# Altium project 3EWL1-200001.PrjPcb
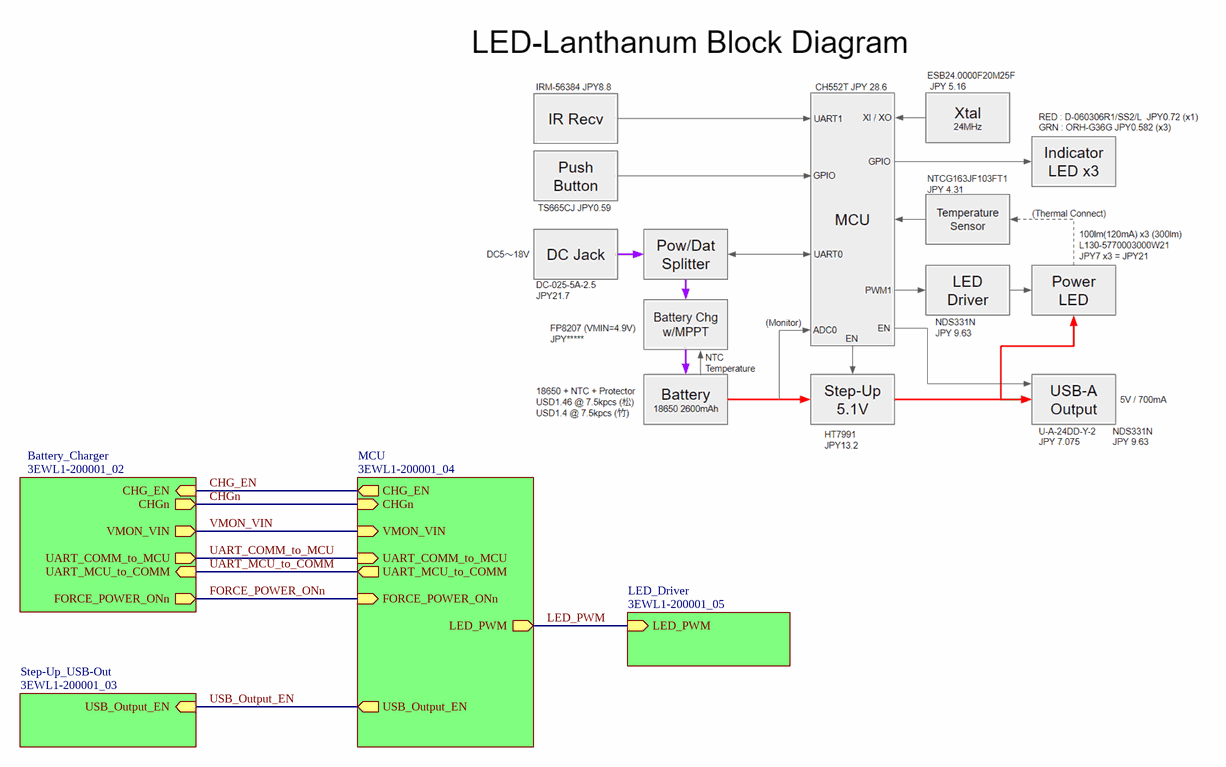
[diagram p0: 3EWL1-200001_01.SchDoc]
5 sheets, 155 parts. Net scope: hierarchical (ports join the sheet entries above them; power ports are global).
Board files: 3EWL1-200001.PcbDoc, 3EWL1-200001_panelize.PcbDoc
Sheets:
  3EWL1-200001_01.SchDoc
    Battery_Charger = 3EWL1-200001_02.SchDoc
    Step-Up_USB-Out = 3EWL1-200001_03.SchDoc
    MCU = 3EWL1-200001_04.SchDoc
    LED_Driver = 3EWL1-200001_05.SchDoc

## Sheet 3EWL1-200001_01.SchDoc: WASSA_Lantern
size A4; Engineer: cronos; Revision: 6A1.0; SheetNumber: 1; SheetTotal: 5

### Sub-sheets
Battery_Charger = 3EWL1-200001_02: CHG_EN (in), VMON_VIN (out), CHGn (out), UART_COMM_to_MCU (out), UART_MCU_to_COMM (in), FORCE_POWER_ONn (out)
LED_Driver = 3EWL1-200001_05: LED_PWM (in)
MCU = 3EWL1-200001_04: USB_Output_EN (out), FORCE_POWER_ONn (in), UART_MCU_to_COMM (out), VMON_VIN (in), CHGn (in), CHG_EN (out), LED_PWM (out), UART_COMM_to_MCU (in)
Step-Up_USB-Out = 3EWL1-200001_03: USB_Output_EN (in)

### Nets
CHG_EN: sheet Battery_Charger/CHG_EN, sheet MCU/CHG_EN
CHGn: sheet Battery_Charger/CHGn, sheet MCU/CHGn
FORCE_POWER_ONn: sheet Battery_Charger/FORCE_POWER_ONn, sheet MCU/FORCE_POWER_ONn
LED_PWM: sheet MCU/LED_PWM, sheet LED_Driver/LED_PWM
UART_COMM_to_MCU: sheet Battery_Charger/UART_COMM_to_MCU, sheet MCU/UART_COMM_to_MCU
UART_MCU_to_COMM: sheet Battery_Charger/UART_MCU_to_COMM, sheet MCU/UART_MCU_to_COMM
USB_Output_EN: sheet Step-Up_USB-Out/USB_Output_EN, sheet MCU/USB_Output_EN
VMON_VIN: sheet Battery_Charger/VMON_VIN, sheet MCU/VMON_VIN

### Notes on the sheet
- Model
- Title
- Rev.
- Size
- Filename
- Comment
- Date
- Design
- A4
- Sheet          of

## Sheet 3EWL1-200001_02.SchDoc: Lantern PowerStage
size A4; Engineer: cronos; Revision: 6A1.0; SheetNumber: 2; SheetTotal: 5
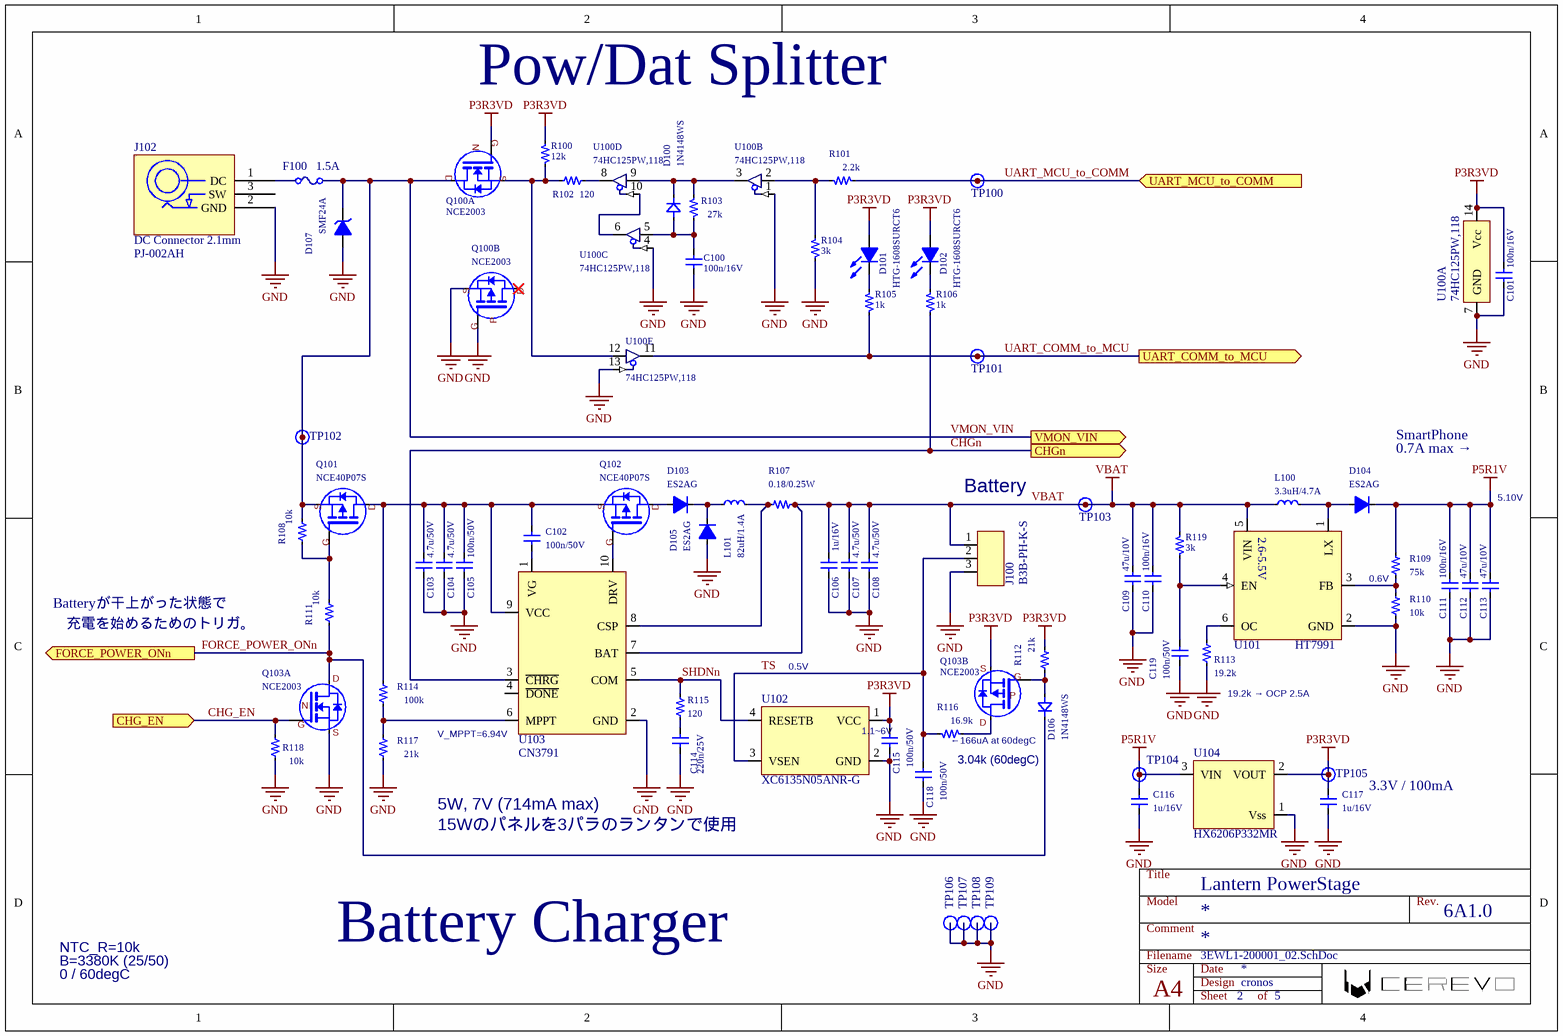
[diagram p1: 3EWL1-200001_02.SchDoc]

### Parts
C100  100n/16V  [SC2-1.00X0.50A]
C101  100n/16V  [SC2-1.00X0.50A]
C102  100n/50V  [SC2-1.00X0.50A]
C103  4.7u/50V  [SC2-3.20X1.60A]
C104  4.7u/50V  [SC2-3.20X1.60A]
C105  100n/50V  [SC2-1.00X0.50A]
C106  1u/16V  [SC2-1.00X0.50A]
C107  4.7u/50V  [SC2-3.20X1.60A]
C108  4.7u/50V  [SC2-3.20X1.60A]
C109  47u/10V  [SC2-3.20X2.50A]
C110  100n/16V  [SC2-1.00X0.50A]
C111  100n/16V  [SC2-1.00X0.50A]
C112  47u/10V  [SC2-3.20X2.50A]
C113  47u/10V  [SC2-3.20X2.50A]
C114  220n/25V  [SC2-1.00X0.50A]
C115  100n/50V  [SC2-1.00X0.50A]
C116  1u/16V  [SC2-1.00X0.50A]
C117  1u/16V  [SC2-1.00X0.50A]
C118  100n/50V  [SC2-1.00X0.50A]
C119  100n/50V  [SC2-1.00X0.50A]
D100  1N4148WS  [SD2-1.7X1.25A]
D101  HTG-1608SURCT6  [SOD-523F_CAPM3216X18N]
D102  HTG-1608SURCT6  [SOD-523F_CAPM3216X18N]
D103  ES2AG  [diodes_SMA]
D104  ES2AG  [diodes_SMA]
D105  ES2AG  [diodes_SMA]
D106  1N4148WS  [SD2-1.7X1.25A]
D107  SMF24A  [SOD-123]
F100  1.5A  [SR2-1.60X0.80A]
J100  B3B-PH-K-S  [B3B-PH-K-S]
J102  DC Connector 2.1mm  Manufacturer Part Number: PJ-002AH  [Connector_PJ-002AH]
L100  3.3uH/4.7A  [VLC6045]
L101  82uH/1.4A  [SCDS125T-820M-N]
Q100  NCE2003  [SOT23-6]  (parts A,B of 2)
Q101  NCE40P07S  [SOIC127P610X104_HS-9M]
Q102  NCE40P07S  [SOIC127P610X104_HS-9M]
Q103  NCE2003  [SOT23-6]  (parts A,B of 2)
R100  12k  [SR2-1.00X0.50A]
R101  2.2k  [SR2-1.00X0.50A]
R102  120  [SR2-1.00X0.50A]
R103  27k  [SR2-1.00X0.50A]
R104  3k  [SR2-1.00X0.50A]
R105  1k  [SR2-1.00X0.50A]
R106  1k  [SR2-1.00X0.50A]
R107  0.18/0.25W  [SR2-3.20X1.60A]
R108  10k  [SR2-1.00X0.50A]
R109  75k  [SR2-1.00X0.50A]
R110  10k  [SR2-1.00X0.50A]
R111  10k  [SR2-1.00X0.50A]
R112  21k  [SR2-1.00X0.50A]
R113  19.2k  [SR2-1.00X0.50A]
R114  100k  [SR2-1.00X0.50A]
R115  120  [SR2-1.00X0.50A]
R116  16.9k  [SR2-1.00X0.50A]
R117  21k  [SR2-1.00X0.50A]
R118  10k  [SR2-1.00X0.50A]
R119  3k  [SR2-1.00X0.50A]
TP100  TP  [1.0mmTH]  (value not drawn)
TP101  TP  [1.0mmTH]  (value not drawn)
TP102  TP  [1.0mmTH]  (value not drawn)
TP103  TP  [1.0mmTH]  (value not drawn)
TP104  TP  [1.0mmTH]  (value not drawn)
TP105  TP  [1.0mmTH]  (value not drawn)
TP106  TP  [1.0mmTH]  (value not drawn)
TP107  TP  [1.0mmTH]  (value not drawn)
TP108  TP  [1.0mmTH]  (value not drawn)
TP109  TP  [1.0mmTH]  (value not drawn)
U100  74HC125PW,118  [TSSOP14_e=0.65]  (parts A,B,C,D,E of 5)
U101  HT7991  [SOT23-6]
U102  XC6135N05ANR-G  [XC6135N05ANR-G]
U103  CN3791  [CN3791]
U104  HX6206P332MR  [SOT23-3]

### Ports
CHG_EN (in), CHGn (out), FORCE_POWER_ONn (out), UART_COMM_to_MCU (out), UART_MCU_to_COMM (in), VMON_VIN (out)

### Nets
GND: C100.2 C101.2 C103.1 C104.1 C105.2 C106.2 C107.1 C108.1 C109.1 C110.2 C111.2 C112.1 C113.1 C114.1 C115.2 C116.2 C117.2 C118.2 C119.2 D105.A D107.A J100.3 J102.2(GND) Q100.2(P_S) Q100.3(P_G) Q103.5(N_S) R104.2 R110.2 R113.2 R117.2 R118.2 TP106.1(TP1) TP107.1(TP1) TP108.1(TP1) TP109.1(TP1) U100.1(1OE) U100.4(2OE) U100.7(GND) U100.13(4OE) U101.2(GND) U102.2(GND) U103.2(GND) U104.1(Vss)
P3R3VD: C101.1 C115.1 C117.1 D101.A D102.A Q100.1(N_G) Q103.2(P_S) R100.1 R112.1 TP105.1(TP1) U100.14(Vcc) U102.1(VCC) U104.2(VOUT)
P5R1V: C111.1 C112.2 C113.2 C116.1 D104.C R109.1 TP104.1(TP1) U104.3(VIN)
VBAT: C106.1 C107.2 C108.2 C109.2 C110.1 J100.1 L100.1 R107.2 R119.1 TP103.1(TP1) U101.5(VIN) U103.7(BAT)
CHG_EN: Q103.1(N_G) R118.1 ; port CHG_EN
CHGn: R106.1 U103.3(~{CHRG}) ; port CHGn
FORCE_POWER_ONn: D106.K Q103.6(N_D) R111.2 ; port FORCE_POWER_ONn
SHDNn: R115.2 U102.4(RESETB) U103.5(COM)
TS: C118.1 J100.2 R116.2 U102.3(VSEN)
UART_COMM_to_MCU: R105.1 TP101.1(TP1) U100.11(4Y) ; port UART_COMM_to_MCU
UART_MCU_to_COMM: R101.1 TP100.1(TP1) ; port UART_MCU_to_COMM
VMON_VIN: D107.C F100.2 Q100.6(N_D) Q101.2(S) R108.1 TP102.1(TP1) ; port VMON_VIN
NetC100_1: C100.1 D100.A R103.2 U100.5(2A)
NetC102_1: C102.1 C103.2 C104.2 C105.1 Q101.3(D) Q102.2(S) R114.1 U103.9(VCC)
NetC102_2: C102.2 U103.1(VG)
NetC114_2: C114.2 R115.1
NetC119_1: C119.1 R119.2 U101.4(EN)
NetD100_K: D100.K R103.1 U100.3(1Y) U100.9(3A)
NetD101_C: D101.C R105.2
NetD102_C: D102.C R106.2
NetD103_A: D103.A Q102.3(D)
NetD103_C: D103.C D105.C L101.1
NetD104_A: D104.A L100.2 U101.1(LX)
NetD106_A: D106.A Q103.3(P_G) R112.2
NetF100_1: F100.1 J102.1(DC)
NetL101_2: L101.2 R107.1 U103.8(CSP)
NetQ100_5: Q100.5(N_S) R100.2 R102.2 U100.12(4A)
NetQ101_1: Q101.1(G) R108.2 R111.1
NetQ102_1: Q102.1(G) U103.10(DRV)
NetQ103_4: Q103.4(P_D) R116.1
NetR101_2: R101.2 R104.1 U100.2(1A)
NetR102_1: R102.1 U100.8(3Y)
NetR109_2: R109.2 R110.1 U101.3(FB)
NetR113_1: R113.1 U101.6(OC)
NetR114_2: R114.2 R117.1 U103.6(MPPT)
NetU100_6: U100.6(2Y) U100.10(3OE)

Not connected (* = marked no-connect by the designer): J102 3(SW); Q100 4(P_D)*; U103 4(~{DONE})

### Notes on the sheet
- Pow/Dat Splitter
- SmartPhone
- Battery
- 0.7A max →
- 5.10V
- 0.6V
- Batteryが干上がった状態で
- 充電を始めるためのトリガ。
- (near U102) 0.5V
- (near R113) 19.2k → OCP 2.5A
- (near U103) V_MPPT=6.94V
- (near R116) ←166uA at 60degC
- 3.04k (60degC)
- 3.3V / 100mA
- 5W, 7V (714mA max)
- 15Wのパネルを3パラのランタンで使用
- 0 / 60degC
- B=3380K (25/50)
- NTC_R=10k
- Battery Charger
- Model
- Title
- Rev.
- Size
- Filename
- Comment
- Date
- Design
- A4
- Sheet          of
- (in symbol HT7991) 2.6-5.5V
- (in symbol NCE2003, part A) D; N; G; S
- (in symbol NCE2003, part B) S; G; P; D
- (in symbol XC6135N05ANR-G) 1.1~6V

### Library data of the parts
C100 C101 C110 C111 = C: 100n, 16V, X7R, 1005Size; Manufacturer: TDK; Manufacturer Part Number: C1005X5R1C104KT000N; Description 1: Capacitor (non-polar); Commodity: MLCC; Replace: OK; FirstPublished: 2012/10/14; LatestRevisionDate: *; LatestRevisionNote: *; Mounting: *; Description 2: *; Footprint(imperial): 0402; Footprint(metric): 1005; Value: 100n/16V
C102 C105 C115 C118 C119 = C: 100n, 50V, X7R, 1005Size; Manufacturer: Walsin; Manufacturer Part Number: 0402B104K500CT; Description 1: Capacitor (non-polar); Commodity: MLCC; Replace: OK; FirstPublished: 2012/10/14; LatestRevisionDate: *; LatestRevisionNote: *; Mounting: *; Description 2: *; Footprint(imperial): 0402; Footprint(metric): 1005; Value: 100n/50V
C103 C104 C107 C108 = C: 4.7u/50V, X7R, 3216Size; Manufacturer: Murata; Manufacturer Part Number: GRM31CR71H475KA12L; Commodity: MLCC; Replace: OK; Mounting: *; Footprint(imperial): 1206; Footprint(metric): 3216; Value: 4.7u/50V
C106 C116 C117 = C: 1u, 16V, X7R, 1005Size; Manufacturer: Yageo; Manufacturer Part Number: CC0805KKX7R7BB105; Description 1: Capacitor (non-polar); Commodity: MLCC; Replace: OK; FirstPublished: 2012/10/14; LatestRevisionDate: *; LatestRevisionNote: *; Mounting: *; Description 2: *; Footprint(imperial): 0402; Footprint(metric): 1005; Value: 1u/16V
C109 C112 C113 = C: 47u/10V, X7R, 3225Size; Manufacturer: Murata; Manufacturer Part Number: GRM32ER71A476KE15L; Commodity: MLCC; Replace: OK; Mounting: *; Footprint(imperial): 1210; Footprint(metric): 3225; Value: 47u/10V
C114 = C: 220n, 25V, X7R, 1005Size; Manufacturer: Walsin; Manufacturer Part Number: 0402B224K250CT; Description 1: Capacitor (non-polar); Commodity: MLCC; Replace: OK; FirstPublished: 2012/10/14; LatestRevisionDate: *; LatestRevisionNote: *; Mounting: *; Description 2: *; Footprint(imperial): 0402; Footprint(metric): 1005; Value: 220n/25V
D100 D106 = 1N4148WS: Diode Signal 75V 150mA 1712; Manufacturer: Fairchild Semiconductor; Description 2: 75V 150MA SOD323F; Commodity: Diode Small Dignal; Replace: OK; Manufacturer Part Number: 1N4148WS; Mounting: *; Value: 1N4148WS
D101 D102 = Diode_LED: Manufacturer: HTGLight; Commodity: LED; Replace: OK; Value: HTG-1608SURCT6; Manufacturer Part Number: HTG-1608SURCT6; Footprint(imperial): 0603; Footprint(metric): 1608
D103-D105 = Diode_switching: 50V, 2A, Vf_2A=1V, 35nSec, SMA; Manufacturer: Shikues; Commodity: Diode; Replace: OK; Manufacturer Part Number: ES2AG; Mounting: *; Value: ES2AG
D107 = Diode_Zenner: Manufacturer: DOWO; Commodity: TVS; Replace: OK; Manufacturer Part Number: SMF24A; Mounting: *; Value: SMF24A
F100 = Fuse: 1.5A, 32V, 1608Size; Manufacturer: Shenzhen lanson Elec; Manufacturer Part Number: 06H1150D; Replace: NG; Commodity: Fuse; Value: 1.5A; Footprint(imperial): 0603; Footprint(metric): 1608
J100 = Con3: PH 3pin 2mm pitch; Manufacturer: JST; Replace: NG; Commodity: Connector; Manufacturer Part Number: B3B-PH-K-S; Mounting: *; Value: B3B-PH-K-S
J102 = Connector - DC_PJ-002AH: Connector - DC 12V; Manufacturer: CUI Inc.; Replace: NG; Mounting: *; Commodity: Connector; Value: PJ-002AH
L100 = L: 3.3uH, 4.7A, 6x6x4.5mm; Manufacturer: TDK; Manufacturer Part Number: VLC6045T-3R3N; Commodity: Inductor; Replace: OK; PackageReference: *; Mounting: *; Footprint (imperial): 6 x 6 x 4.5mm; Value: 3.3uH/4.7A
L101 = L: 82uH, 1.4A, 12.5x12.5x6mm; Manufacturer: Chilisin Elec; Commodity: Inductor; Replace: OK; PackageReference: *; Manufacturer Part Number: SCDS125T-820M-N; Mounting: *; Footprint (imperial): 12.5 x 12.5 x 6.0mm; Value: 82uH/1.4A
Q100 Q103 = NCE2003: N(20V, 55mohm, Vgs(th)=1.2V ), P(-20V, 100mohm, Vgs(th)=-1V), SOT23-6; Manufacturer: ncepower; Commodity: MOSFET; Replace: OK; Mounting: *; Manufacturer Part Number: NCE2003; Value: NCE2003
Q101 Q102 = Pch_MOSFET: -40V, -6.2A, 30mohm; pin to pad: 1>2 2>1; Manufacturer: Wuxi NCE Power Semiconductor; Commodity: MOSFET; Replace: OK; Manufacturer Part Number: NCE40P07S; Mounting: *; Value: NCE40P07S
R100 = R: 12k, 1%, 1005Size; Manufacturer: YAGEO; Manufacturer Part Number: RC0402FR-0712KL; Description 1: Resistor; Replace: OK; FirstPublished: 2012/10/14; LatestRevisionDate: *; LatestRevisionNote: *; PackageReference: *; Mounting: *; Description 2: *; Value: 12k; Commodity: Resistor; Footprint(imperial): 0402; Footprint(metric): 1005
R101 = R: 2.2k, 1%, 1005Size; Manufacturer: YAGEO; Manufacturer Part Number: RC0402FR-072K2RL; Description 1: Resistor; Replace: OK; FirstPublished: 2012/10/14; LatestRevisionDate: *; LatestRevisionNote: *; PackageReference: *; Mounting: *; Description 2: *; Value: 2.2k; Commodity: Resistor; Footprint(imperial): 0402; Footprint(metric): 1005
R102 R115 = R: 120, 1%, 1005Size; Manufacturer: YAGEO; Manufacturer Part Number: RC0402FR-07120RL; Description 1: Resistor; Replace: OK; FirstPublished: 2012/10/14; LatestRevisionDate: *; LatestRevisionNote: *; PackageReference: *; Mounting: *; Description 2: *; Value: 120; Commodity: Resistor; Footprint(imperial): 0402; Footprint(metric): 1005
R103 = R: 27k, 1%, 1005Size; Manufacturer: YAGEO; Manufacturer Part Number: RC0402FR-0727KL; Description 1: Resistor; Replace: OK; FirstPublished: 2012/10/14; LatestRevisionDate: *; LatestRevisionNote: *; PackageReference: *; Mounting: *; Description 2: *; Value: 27k; Commodity: Resistor; Footprint(imperial): 0402; Footprint(metric): 1005
R104 R119 = R: 3k, 1%, 1005Size; Manufacturer: YAGEO; Manufacturer Part Number: RC0402FR-073KL; Description 1: Resistor; Replace: OK; FirstPublished: 2012/10/14; LatestRevisionDate: *; LatestRevisionNote: *; PackageReference: *; Mounting: *; Description 2: *; Value: 3k; Commodity: Resistor; Footprint(imperial): 0402; Footprint(metric): 1005
R105 R106 = R: Rsisiter 2pin; Manufacturer: Yageo; Manufacturer Part Number: RC0402FR-071KL; Description 1: Resistor; Replace: OK; FirstPublished: 2012/10/14; LatestRevisionDate: *; LatestRevisionNote: *; Mounting: *; Description 2: *; Commodity: Resistor; Footprint(imperial): 0402; Footprint(metric): 1005; Value: 1k
R107 = R: 0.18, 0.25W, 1%, 800ppm; Manufacturer: UNI-ROYAL; Manufacturer Part Number: 1206W4F180LT5E; Commodity: Resistor; Replace: OK; Mounting: *; Footprint(imperial): 1206; Footprint(metric): 3216; Value: 0.18/0.25W
R108 R110 R111 R118 = R: Manufacturer: YAGEO; Manufacturer Part Number: RC0402FR-0710KL; Description 1: Resistor; Replace: OK; FirstPublished: 2012/10/14; LatestRevisionDate: *; LatestRevisionNote: *; PackageReference: *; Mounting: *; Description 2: *; Value: 10k; Commodity: Resistor; Footprint(imperial): 0402; Footprint(metric): 1005
R109 = R: Manufacturer: YAGEO; Manufacturer Part Number: RC0402FR-0775KL; Description 1: Resistor; Replace: OK; FirstPublished: 2012/10/14; LatestRevisionDate: *; LatestRevisionNote: *; PackageReference: *; Mounting: *; Description 2: *; Value: 75k; Commodity: Resistor; Footprint(imperial): 0402; Footprint(metric): 1005
R112 R117 = R: 21k, 1%, 1005Size; Manufacturer: YAGEO; Manufacturer Part Number: RC0402FR-0721KL; Description 1: Resistor; Replace: OK; FirstPublished: 2012/10/14; LatestRevisionDate: *; LatestRevisionNote: *; PackageReference: *; Mounting: *; Description 2: *; Value: 21k; Commodity: Resistor; Footprint(imperial): 0402; Footprint(metric): 1005
R113 = R: Manufacturer: YAGEO; Manufacturer Part Number: RC0402FR-0719K2L; Description 1: Resistor; Replace: OK; FirstPublished: 2012/10/14; LatestRevisionDate: *; LatestRevisionNote: *; PackageReference: *; Mounting: *; Description 2: *; Value: 19.2k; Commodity: Resistor; Footprint(imperial): 0402; Footprint(metric): 1005
R114 = R: 100k, 1%, 1005Size; Manufacturer: YAGEO; Manufacturer Part Number: RC0402FR-07100KL; Description 1: Resistor; Replace: OK; FirstPublished: 2012/10/14; LatestRevisionDate: *; LatestRevisionNote: *; PackageReference: *; Mounting: *; Description 2: *; Value: 100k; Commodity: Resistor; Footprint(imperial): 0402; Footprint(metric): 1005
R116 = R: 16.9k, 1%, 1005Size; Manufacturer: YAGEO; Manufacturer Part Number: RC0402FR-0716K9L; Description 1: Resistor; Replace: OK; FirstPublished: 2012/10/14; LatestRevisionDate: *; LatestRevisionNote: *; PackageReference: *; Mounting: *; Description 2: *; Value: 16.9k; Commodity: Resistor; Footprint(imperial): 0402; Footprint(metric): 1005
TP100-TP109 = TP: Mounting: NM
U100 = 74HC125: 3-State Quad Buffer; Manufacturer: NXP; Commodity: Logic; Replace: OK; Manufacturer Part Number: 74HC125PW,118; Mounting: *; Value: 74HC125PW,118
U101 = HT7991: boost, 2.6-5.5V, 2.5A, 1MHz; Manufacturer: Holtek; Commodity: SMPS; Replace: OK; Manufacturer Part Number: HT7991; Mounting: *; Value: HT7991
U102 = XC6135N05ANR-G: Voltage Detector Vth=0.5V; Manufacturer: TOREX; Replace: OK; Commodity: Voltage Detector; Manufacturer Part Number: XC6135N05ANR-G; Mounting: *; Value: XC6135N05ANR-G
U103 = CN3791: 8:1 Multiplexer; Manufacturer: CONSONANCE; Commodity: Li Charger; Replace: OK; Manufacturer Part Number: CN3791; Mounting: *; Value: CN3791
U104 = HX6206P332MR: 3.3V 100mA SOT-23; Manufacturer: hengjiaxing; Commodity: Linear Voltage Reg; Replace: NG; Manufacturer Part Number: HX6206P332MR; Value: HX6206P332MR

## Sheet 3EWL1-200001_03.SchDoc: Lantern USB-PowerPort
size A4; Engineer: cronos; Revision: 6A1.0; SheetNumber: 3; SheetTotal: 5
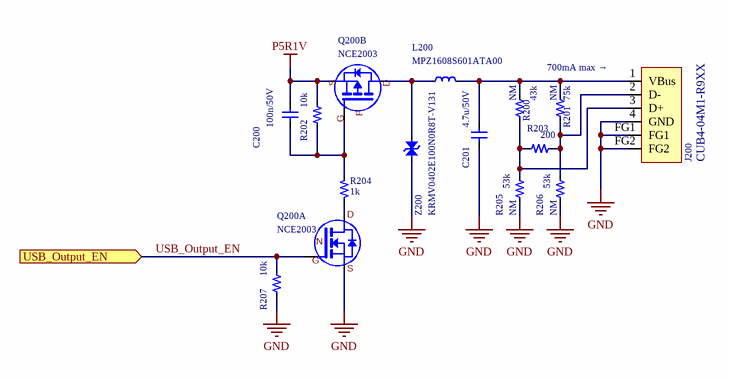
[diagram p2: 3EWL1-200001_03.SchDoc]

### Parts
C200  100n/50V  [SC2-1.00X0.50A]
C201  4.7u/50V  [SC2-3.20X1.60A]
J200  CUB4-04M1-R9XX  [CUB4-04M1-R9XX]
L200  MPZ1608S601ATA00  [SL2-1.60X0.80A]
Q200  NCE2003  [SOT23-6]  (parts A,B of 2)
R200  Mounting: NM  [SR2-1.00X0.50A]  (hidden comment: 43k)
R201  Mounting: NM  [SR2-1.00X0.50A]  (hidden comment: 75k)
R202  10k  [SR2-1.00X0.50A]
R203  200  [SR2-1.00X0.50A]
R204  1k  [SR2-1.00X0.50A]
R205  Mounting: NM  [SR2-1.00X0.50A]  (hidden comment: 53k)
R206  Mounting: NM  [SR2-1.00X0.50A]  (hidden comment: 53k)
R207  10k  [SR2-1.00X0.50A]
Z200  KRMV0402E100N0R8T-V131  [SR2-1.00X0.50A]

### Ports
USB_Output_EN (in)

### Nets
GND: C201.1 J200.4(GND) J200.FG1 J200.FG2 Q200.5(N_S) R205.2 R206.2 R207.2 Z200.1
P5R1V: C200.1 Q200.2(P_S) R202.1
USB_Output_EN: Q200.1(N_G) R207.1 ; port USB_Output_EN
NetC200_2: C200.2 Q200.3(P_G) R202.2 R204.2
NetC201_2: C201.2 J200.1(VBus) L200.2 R200.1 R201.1
NetJ200_2: J200.2(D-) R201.2 R203.2 R206.1
NetJ200_3: J200.3(D+) R200.2 R203.1 R205.1
NetL200_1: L200.1 Q200.4(P_D) Z200.2
NetQ200_6: Q200.6(N_D) R204.1

### Notes on the sheet
- 700mA max →
- Model
- Title
- Rev.
- Size
- Filename
- Comment
- Date
- Design
- A4
- Sheet          of
- (in symbol NCE2003, part A) D; N; G; S
- (in symbol NCE2003, part B) S; D; P; G

### Library data of the parts
C200 = C: as C102 on sheet 3EWL1-200001_02; FirstPublished: 2012/10/14; LatestRevisionDate: *; LatestRevisionNote: *; Mounting: *; Description 2: *; Footprint(imperial): 0402; Footprint(metric): 1005; Value: 100n/50V
C201 = C: as C103 on sheet 3EWL1-200001_02; Mounting: *; Footprint(imperial): 1206; Footprint(metric): 3216; Value: 4.7u/50V
J200 = CUB4-04M1-R9XX: USB-A; Manufacturer: Youte Electronic; Replace: OK; Value: CUB4-04M1-R9XX; Mounting: *; Manufacturer Part Number: CUB4-04M1-R9XX
L200 = L: 600ohm/1.0A/150mohm; Manufacturer: TDK; Commodity: RFC; Replace: OK; FirstPublished: 2012/10/14; LatestRevisionDate: *; LatestRevisionNote: *; PackageReference: *; Manufacturer Part Number: MPZ1608S601ATA00; Mounting: *; Footprint(imperial): '0603; Footprint(metric): 1608; Value: 600ohm/1.0A/150mohm
Q200 = NCE2003: as Q100 on sheet 3EWL1-200001_02; Mounting: *; Manufacturer Part Number: NCE2003; Value: NCE2003
R200 = R: Manufacturer: YAGEO; Manufacturer Part Number: RC0402FR-0743KL; Description 1: Resistor; Replace: OK; FirstPublished: 2012/10/14; LatestRevisionDate: *; LatestRevisionNote: *; PackageReference: *; Description 2: *; Value: 43k; Commodity: Resistor; Footprint(imperial): 0402; Footprint(metric): 1005
R201 = R: as R109 on sheet 3EWL1-200001_02; FirstPublished: 2012/10/14; LatestRevisionDate: *; LatestRevisionNote: *; PackageReference: *; Description 2: *; Value: 75k; Commodity: Resistor; Footprint(imperial): 0402; Footprint(metric): 1005
R202 R207 = R: as R108 on sheet 3EWL1-200001_02; FirstPublished: 2012/10/14; LatestRevisionDate: *; LatestRevisionNote: *; PackageReference: *; Mounting: *; Description 2: *; Value: 10k; Commodity: Resistor; Footprint(imperial): 0402; Footprint(metric): 1005
R203 = R: Manufacturer: YAGEO; Manufacturer Part Number: RC0402FR-07200RL; Description 1: Resistor; Replace: OK; FirstPublished: 2012/10/14; LatestRevisionDate: *; LatestRevisionNote: *; PackageReference: *; Mounting: *; Description 2: *; Value: 200; Commodity: Resistor; Footprint(imperial): 0402; Footprint(metric): 1005
R204 = R: as R105 on sheet 3EWL1-200001_02; FirstPublished: 2012/10/14; LatestRevisionDate: *; LatestRevisionNote: *; Mounting: *; Description 2: *; Commodity: Resistor; Footprint(imperial): 0402; Footprint(metric): 1005; Value: 1k
R205 R206 = R: Manufacturer: YAGEO; Manufacturer Part Number: RC0402FR-0753KL; Description 1: Resistor; Replace: OK; FirstPublished: 2012/10/14; LatestRevisionDate: *; LatestRevisionNote: *; PackageReference: *; Description 2: *; Value: 53k; Commodity: Resistor; Footprint(imperial): 0402; Footprint(metric): 1005
Z200 = EZA-EG3A50AV: ESD Suppressor; Manufacturer: GRACE; Description 2: SUPPRESSOR ESD 10V 0402; Replace: NG; FirstPublished: 2012/10/14; LatestRevisionDate: *; LatestRevisionNote: *; PackageReference: 1005; PackageDescription: SZ2-1.00X0.50A; Manufacturer Part Number: KRMV0402E100N0R8T-V131; Mounting: *; Description 1: ESD Suppressor; Value: KRMV0402E100N0R8T-V131; Footprint(imperial): 0402; Footprint(metric): 1005; Commodity: ESD Suppressor

## Sheet 3EWL1-200001_04.SchDoc: Lantern MCU
size A4; Engineer: cronos; Revision: 6A1.0; SheetNumber: 4; SheetTotal: 5
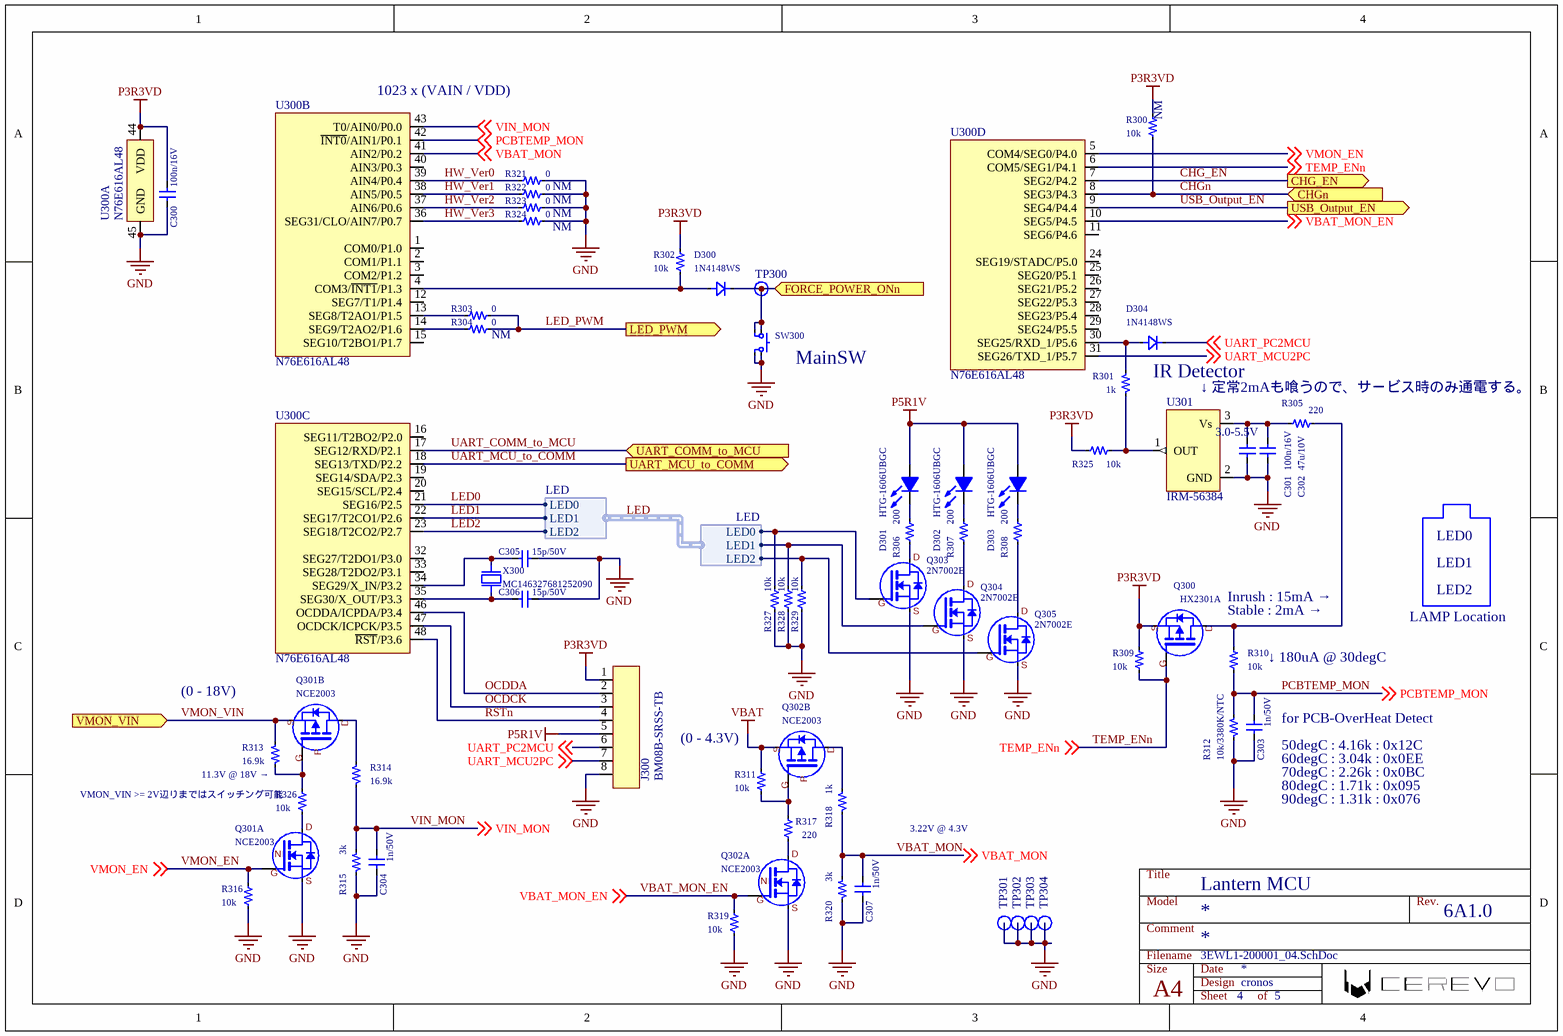
[diagram p3: 3EWL1-200001_04.SchDoc]

### Parts
C300  100n/16V  [SC2-1.00X0.50A]
C301  100n/16V  [SC2-1.00X0.50A]
C302  47u/10V  [SC2-3.20X2.50A]
C303  1n/50V  [SC2-1.00X0.50A]
C304  1n/50V  [SC2-1.00X0.50A]
C305  15p/50V  [SC2-1.00X0.50A]
C306  15p/50V  [SC2-1.00X0.50A]
C307  1n/50V  [SC2-1.00X0.50A]
D300  1N4148WS  [SD2-1.7X1.25A]
D301  HTG-1606UBGC  [HTG-1606UBGC]
D302  HTG-1606UBGC  [HTG-1606UBGC]
D303  HTG-1606UBGC  [HTG-1606UBGC]
D304  1N4148WS  [SD2-1.7X1.25A]
J300  BM08B-SRSS-TB  [BM08B-SRSS-TB]
Q300  HX2301A  [SOT23P245X120-3N]
Q301  NCE2003  [SOT23-6]  (parts A,B of 2)
Q302  NCE2003  [SOT23-6]  (parts A,B of 2)
Q303  2N7002E  [SOT23P245X120-3N]
Q304  2N7002E  [SOT23P245X120-3N]
Q305  2N7002E  [SOT23P245X120-3N]
R300  Mounting: NM  [SR2-1.00X0.50A]  (hidden comment: 10k)
R301  1k  [SR2-1.00X0.50A]
R302  10k  [SR2-1.00X0.50A]
R303  0  [SR2-1.00X0.50A]
R304  Mounting: NM  [SR2-1.00X0.50A]  (hidden comment: 0)
R305  220  [SR2-1.00X0.50A]
R306  200  [SR2-1.00X0.50A]
R307  200  [SR2-1.00X0.50A]
R308  200  [SR2-1.00X0.50A]
R309  10k  [SR2-1.00X0.50A]
R310  10k  [SR2-1.00X0.50A]
R311  10k  [SR2-1.00X0.50A]
R312  10k/3380K/NTC  [SR2-1.00X0.50A]
R313  16.9k  [SR2-1.00X0.50A]
R314  16.9k  [SR2-1.00X0.50A]
R315  3k  [SR2-1.00X0.50A]
R316  10k  [SR2-1.00X0.50A]
R317  220  [SR2-1.00X0.50A]
R318  1k  [SR2-1.00X0.50A]
R319  10k  [SR2-1.00X0.50A]
R320  3k  [SR2-1.00X0.50A]
R321  Mounting: NM  [SR2-1.00X0.50A]  (hidden comment: 0)
R322  Mounting: NM  [SR2-1.00X0.50A]  (hidden comment: 0)
R323  Mounting: NM  [SR2-1.00X0.50A]  (hidden comment: 0)
R324  Mounting: NM  [SR2-1.00X0.50A]  (hidden comment: 0)
R325  10k  [SR2-1.00X0.50A]
R326  10k  [SR2-1.00X0.50A]
R327  10k  [SR2-1.00X0.50A]
R328  10k  [SR2-1.00X0.50A]
R329  10k  [SR2-1.00X0.50A]
SW300  1825910  [1825910]  (value not drawn)
TP300  TP  [1.0mmTH]  (value not drawn)
TP301  TP  [1.0mmTH]  (value not drawn)
TP302  TP  [1.0mmTH]  (value not drawn)
TP303  TP  [1.0mmTH]  (value not drawn)
TP304  TP  [1.0mmTH]  (value not drawn)
U300  N76E616AL48  [N76E616AL48]  (parts A,B,C,D of 4)
U301  IRM-56384  [IRM-56384]
X300  MC146327681252090  [MC146327681252090]

### Ports
CHG_EN (out), CHGn (in), FORCE_POWER_ONn (in), LED_PWM (out), UART_COMM_to_MCU (in), UART_MCU_to_COMM (out), USB_Output_EN (out), VMON_VIN (in)

### Harnesses
LED: LED0, LED1, LED2

### Nets
GND: C300.2 C301.2 C302.1 C303.2 C304.2 C305.2 C306.2 C307.2 J300.8 Q301.5(N_S) Q302.5(N_S) Q303.2(S) Q304.2(S) Q305.2(S) R312.2 R315.2 R316.2 R319.2 R320.2 R321.2 R322.2 R323.2 R324.2 R327.2 R328.2 R329.2 SW300.3 SW300.4 TP301.1(TP1) TP302.1(TP1) TP303.1(TP1) TP304.1(TP1) U300.45(GND) U301.2(GND)
P3R3VD: C300.1 J300.1 Q300.2(S) R300.1 R302.1 R309.1 R325.1 U300.44(VDD)
P5R1V: D301.A D302.A D303.A J300.5
VBAT: Q302.2(P_S) R311.1
CHG_EN: U300.7(SEG2/P4.2) ; port CHG_EN
CHGn: R300.2 U300.8(SEG3/P4.3) ; port CHGn
FORCE_POWER_ONn: D300.K SW300.1 SW300.2 TP300.1(TP1) ; port FORCE_POWER_ONn
HW_Ver0: R321.1 U300.39(AIN4/P0.4)
HW_Ver1: R322.1 U300.38(AIN5/P0.5)
HW_Ver2: R323.1 U300.37(AIN6/P0.6)
HW_Ver3: R324.1 U300.36(SEG31/CLO/AIN7/P0.7)
LED0: Q303.1(G) R327.1 U300.21(SEG16/P2.5) ; harness LED.LED0  [project net LED.LED0]
LED1: Q304.1(G) R328.1 U300.22(SEG17/T2CO1/P2.6) ; harness LED.LED1  [project net LED.LED1]
LED2: Q305.1(G) R329.1 U300.23(SEG18/T2CO2/P2.7) ; harness LED.LED2  [project net LED.LED2]
LED_PWM: R303.2 R304.2 ; port LED_PWM
OCDCK: J300.3 U300.47(OCDCK/ICPCK/P3.5)
OCDDA: J300.2 U300.46(OCDDA/ICPDA/P3.4)
PCBTEMP_MON: C303.1 R310.2 R312.1 U300.42(~{INT0}/AIN1/P0.1) ; off-sheet PCBTEMP_MON
RSTn: J300.4 U300.48(~{RST}/P3.6)
TEMP_ENn: Q300.1(G) R309.2 U300.6(COM5/SEG1/P4.1) ; off-sheet TEMP_ENn
UART_COMM_to_MCU: U300.17(SEG12/RXD/P2.1) ; port UART_COMM_to_MCU
UART_MCU2PC: J300.7 U300.31(SEG26/TXD_1/P5.7) ; off-sheet UART_MCU2PC
UART_MCU_to_COMM: U300.18(SEG13/TXD/P2.2) ; port UART_MCU_to_COMM
UART_PC2MCU: D304.K J300.6 ; off-sheet UART_PC2MCU
USB_Output_EN: U300.9(SEG4/P4.4) ; port USB_Output_EN
VBAT_MON: C307.1 R318.1 R320.1 U300.41(AIN2/P0.2) ; off-sheet VBAT_MON
VBAT_MON_EN: Q302.1(N_G) R319.1 U300.10(SEG5/P4.5) ; off-sheet VBAT_MON_EN
VIN_MON: C304.1 R314.2 R315.1 U300.43(T0/AIN0/P0.0) ; off-sheet VIN_MON
VMON_EN: Q301.1(N_G) R316.1 U300.5(COM4/SEG0/P4.0) ; off-sheet VMON_EN
VMON_VIN: Q301.2(P_S) R313.1 ; port VMON_VIN
NetC301_1: C301.1 C302.2 R305.2 U301.3(Vs)
NetC305_1: C305.1 U300.34(SEG29/X_IN/P3.2) X300.2(X2)
NetC306_1: C306.1 U300.35(SEG30/X_OUT/P3.3) X300.1(X1)
NetD300_A: D300.A R302.2 U300.4(COM3/~{INT1}/P1.3)
NetD301_C: D301.C R306.2
NetD302_C: D302.C R307.2
NetD303_C: D303.C R308.2
NetD304_A: D304.A R301.2 U300.30(SEG25/RXD_1/P5.6)
NetQ300_3: Q300.3(D) R305.1 R310.1
NetQ301_3: Q301.3(P_G) R313.2 R326.1
NetQ301_4: Q301.4(P_D) R314.1
NetQ301_6: Q301.6(N_D) R326.2
NetQ302_3: Q302.3(P_G) R311.2 R317.1
NetQ302_4: Q302.4(P_D) R318.2
NetQ302_6: Q302.6(N_D) R317.2
NetQ303_3: Q303.3(D) R306.1
NetQ304_3: Q304.3(D) R307.1
NetQ305_3: Q305.3(D) R308.1
NetR301_1: R301.1 R325.2 U301.1(OUT)
NetR303_1: R303.1 U300.13(SEG8/T2AO1/P1.5)
NetR304_1: R304.1 U300.14(SEG9/T2AO2/P1.6)

Not connected (* = marked no-connect by the designer): U300 1(COM0/P1.0) 2(COM1/P1.1) 3(COM2/P1.2) 11(SEG6/P4.6) 12(SEG7/T1/P1.4) 15(SEG10/T2BO1/P1.7) 16(SEG11/T2BO2/P2.0) 19(SEG14/SDA/P2.3) 20(SEG15/SCL/P2.4) 24(SEG19/STADC/P5.0) 25(SEG20/P5.1) 26(SEG21/P5.2) 27(SEG22/P5.3) 28(SEG23/P5.4) 29(SEG24/P5.5) 32(SEG27/T2DO1/P3.0) 33(SEG28/T2DO2/P3.1) 40(AIN3/P0.3)

### Notes on the sheet
- (near U300) 1023 x (VAIN / VDD)
- (near SW300) MainSW
- IR Detector
- ↓ 定常2mAも喰うので、サービス時のみ通電する。
- LED0
- LED1
- Inrush : 15mA →
- Stable : 2mA →
- LAMP Location
- LED2
- (0 - 18V)
- (near R310) ↓ 180uA @ 30degC
- (near R313) 11.3V @ 18V →
- (0 - 4.3V)
- (near C303) for PCB-OverHeat Detect
- (near C303) 50degC : 4.16k : 0x12C
- 60degC : 3.04k : 0x0EE
- 70degC : 2.26k : 0x0BC
- 80degC : 1.71k : 0x095
- VMON_VIN >= 2V辺りまではスイッチング可能
- 3.22V @ 4.3V
- 90degC : 1.31k : 0x076
- Model
- Title
- Rev.
- Size
- Filename
- Comment
- Date
- Design
- A4
- Sheet          of
- (in symbol IRM-56384) 3.0-5.5V
- (in symbol NCE2003, part A) D; N; G; S
- (in symbol NCE2003, part B) S; D; P; G

### Library data of the parts
C300 C301 = C: as C100 on sheet 3EWL1-200001_02; FirstPublished: 2012/10/14; LatestRevisionDate: *; LatestRevisionNote: *; Mounting: *; Description 2: *; Footprint(imperial): 0402; Footprint(metric): 1005; Value: 100n/16V
C302 = C: as C109 on sheet 3EWL1-200001_02; Mounting: *; Footprint(imperial): 1210; Footprint(metric): 3225; Value: 47u/10V
C303 C304 C307 = C: 1n/50V, C0G, 0402Size; Manufacturer: Murata; Manufacturer Part Number: GRM1555C1H102JA01D; Description 1: Capacitor (non-polar); Commodity: MLCC; Replace: OK; FirstPublished: 2012/10/14; LatestRevisionDate: *; LatestRevisionNote: *; Mounting: *; Description 2: *; Footprint(imperial): 0402; Footprint(metric): 1005; Value: 1n/50V
C305 C306 = C: 15p/50V, C0G, 0402Size; Manufacturer: YAGEO; Manufacturer Part Number: CC0201JRNPO9BN150; Description 1: Capacitor (non-polar); Commodity: MLCC; Replace: OK; FirstPublished: 2012/10/14; LatestRevisionDate: *; LatestRevisionNote: *; Mounting: *; Description 2: *; Footprint(imperial): 0402; Footprint(metric): 1005; Value: 15p/50V
D300 D304 = 1N4148WS: as D100 on sheet 3EWL1-200001_02; Manufacturer Part Number: 1N4148WS; Mounting: *; Value: 1N4148WS
D301-D303 = Diode_LED: as D101 on sheet 3EWL1-200001_02; Value: HTG-1606UBGC; Manufacturer Part Number: HTG-1606UBGC; Footprint(imperial): 0603; Footprint(metric): 1606
J300 = Con8: Manufacturer: JST; Replace: NG; Commodity: Connector; Manufacturer Part Number: BM08B-SRSS-TB; Mounting: *; Value: BM08B-SRSS-TB
Q300 = Pch_MOSFET: 20V, 2.5A, 150mohm; Manufacturer Part Number: hengjiaxing; Replace: OK; Manufacturer: HX2301A; Mounting: *; Value: HX2301A
Q301 Q302 = NCE2003: as Q100 on sheet 3EWL1-200001_02; Mounting: *; Manufacturer Part Number: NCE2003; Value: NCE2003
Q303-Q305 = Nch_MOSFET: 60V, 300mA, 2.5V, 3ohm; Commodity: FET; Mounting: SLKORMICRO Elec; Manufacturer Part Number: 2N7002E; Manufacturer: *; Replace: *; Value: 2N7002E
R300 R302 R309-R311 R316 R319 R325-R329 = R: as R108 on sheet 3EWL1-200001_02; FirstPublished: 2012/10/14; LatestRevisionDate: *; LatestRevisionNote: *; PackageReference: *; Description 2: *; Value: 10k; Commodity: Resistor; Footprint(imperial): 0402; Footprint(metric): 1005
  R302 R309-R311 R316 R319 R325-R329: Mounting: *
R301 R318 = R: as R105 on sheet 3EWL1-200001_02; FirstPublished: 2012/10/14; LatestRevisionDate: *; LatestRevisionNote: *; Mounting: *; Description 2: *; Commodity: Resistor; Footprint(imperial): 0402; Footprint(metric): 1005; Value: 1k
R303 R304 R321-R324 = R: Rsisiter 2pin; Manufacturer: YAGEO; Manufacturer Part Number: RC0402FR-07KL; Description 1: Resistor; Replace: OK; FirstPublished: 2012/10/14; LatestRevisionDate: *; LatestRevisionNote: *; PackageReference: *; Description 2: *; Value: 0; Commodity: Resistor; Footprint(imperial): 0402; Footprint(metric): 1005
  R303: Mounting: *
R305 R317 = R: 220, 1%, 1005Size; Manufacturer: YAGEO; Manufacturer Part Number: RC0402FR-07220RL; Description 1: Resistor; Replace: OK; FirstPublished: 2012/10/14; LatestRevisionDate: *; LatestRevisionNote: *; PackageReference: *; Mounting: *; Description 2: *; Value: 220; Commodity: Resistor; Footprint(imperial): 0402; Footprint(metric): 1005
R306-R308 = R: as R203 on sheet 3EWL1-200001_03; FirstPublished: 2012/10/14; LatestRevisionDate: *; LatestRevisionNote: *; PackageReference: *; Mounting: *; Description 2: *; Value: 200; Commodity: Resistor; Footprint(imperial): 0402; Footprint(metric): 1005
R312 = R: NTC, 10k, 1%, B=3380K; Manufacturer: TDK; Manufacturer Part Number: NTCG163JF103FT1; Description 1: Resistor; Replace: OK; FirstPublished: 2012/10/14; LatestRevisionDate: *; LatestRevisionNote: *; PackageReference: *; Mounting: *; Description 2: *; Value: 10k/3380K/NTC; Commodity: Resistor; Footprint(imperial): 0402; Footprint(metric): 1005
R313 R314 = R: as R116 on sheet 3EWL1-200001_02; FirstPublished: 2012/10/14; LatestRevisionDate: *; LatestRevisionNote: *; PackageReference: *; Mounting: *; Description 2: *; Value: 16.9k; Commodity: Resistor; Footprint(imperial): 0402; Footprint(metric): 1005
R315 R320 = R: as R104 on sheet 3EWL1-200001_02; FirstPublished: 2012/10/14; LatestRevisionDate: *; LatestRevisionNote: *; PackageReference: *; Mounting: *; Description 2: *; Value: 3k; Commodity: Resistor; Footprint(imperial): 0402; Footprint(metric): 1005
SW300 = TactSW: TE SPST TactSW; Manufacturer: TE Connectivity; Value: 3-1825910-9; Replace: OK; Mounting: *; Manufacturer Part Number: 3-1825910-9; Commodity: *
TP300-TP304 = TP: Mounting: NM
U300 = N76E616AL48: 8051; Manufacturer: nuvoton; Commodity: MCU; Replace: OK; Manufacturer Part Number: N76E616AL48; Mounting: *; Value: N76E616AL48
U301 = IRM-56384: IR Receiver 38kHz, 940nm, 3.0-5.5V; Manufacturer: Everlight; Commodity: IR-Receiver; Replace: OK; Manufacturer Part Number: IRM-56384; Mounting: *; Value: IRM-56384
X300 = X'tal_Resonator: 32.768kHz 20ppm, 12.5pF; Manufacturer: JGHC; Commodity: X'tal; Replace: OK; Manufacturer Part Number: MC146327681252090; Mounting: *; Value: MC146327681252090

## Sheet 3EWL1-200001_05.SchDoc: Lantern LED Driver
size A4; Engineer: cronos; Revision: 6A1.0; SheetNumber: 5; SheetTotal: 5
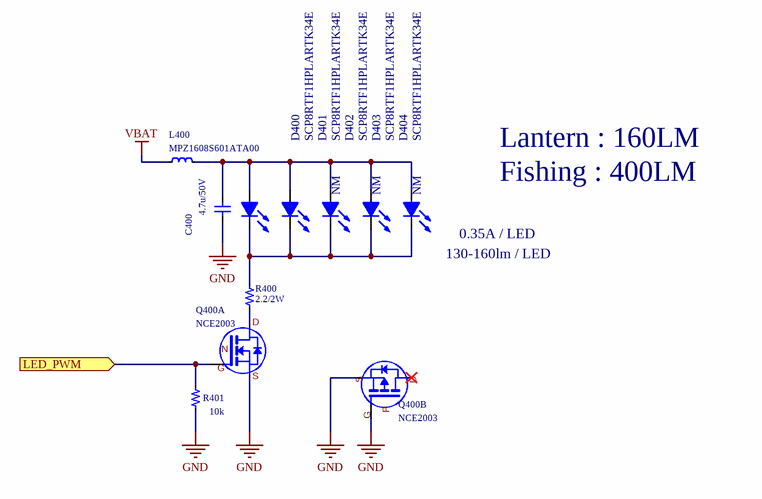
[diagram p4: 3EWL1-200001_05.SchDoc]

### Parts
C400  4.7u/50V  [SC2-3.20X1.60A]
D400  SCP8RTF1HPLARTK34E  [SCP8RTF1HPLARTK34E]
D401  SCP8RTF1HPLARTK34E  [SCP8RTF1HPLARTK34E]
D402  Mounting: NM  [SCP8RTF1HPLARTK34E]  (hidden comment: SCP8RTF1HPLARTK34E)
D403  Mounting: NM  [SCP8RTF1HPLARTK34E]  (hidden comment: SCP8RTF1HPLARTK34E)
D404  Mounting: NM  [SCP8RTF1HPLARTK34E]  (hidden comment: SCP8RTF1HPLARTK34E)
L400  MPZ1608S601ATA00  [SL2-1.60X0.80A]
Q400  NCE2003  [SOT23-6]  (parts A,B of 2)
R400  2.2/2W  [SR2-6.40x3.20A]
R401  10k  [SR2-1.00X0.50A]

### Ports
LED_PWM (in)

### Nets
GND: C400.1 Q400.2(P_S) Q400.3(P_G) Q400.5(N_S) R401.2
VBAT: L400.1
LED_PWM: Q400.1(N_G) R401.1 ; port LED_PWM
NetC400_2: C400.2 D400.A D401.A D402.A D403.A D404.A L400.2
NetD400_C: D400.C D401.C D402.C D403.C D404.C R400.1
NetQ400_6: Q400.6(N_D) R400.2

Not connected (* = marked no-connect by the designer): Q400 4(P_D)*

### Notes on the sheet
- Lantern : 160LM
- Fishing : 400LM
- (near D404) 130-160lm / LED
- (near D404) 0.35A / LED
- Model
- Title
- Rev.
- Size
- Filename
- Comment
- Date
- Design
- A4
- Sheet          of
- (in symbol NCE2003, part A) D; N; G; S
- (in symbol NCE2003, part B) S; D; P; G

### Library data of the parts
C400 = C: as C103 on sheet 3EWL1-200001_02; Mounting: *; Footprint(imperial): 1206; Footprint(metric): 3216; Value: 4.7u/50V
D400-D404 = Diode_LED: 2.75-3.4V, 315-363lm/A, 1919Size, SMT; Manufacturer: SAMSUNG; Commodity: LED; Replace: NG; Manufacturer Part Number: SCP8RTF1HPLARTK34E; Value: SCP8RTF1HPLARTK34E
  D400 D401: Mounting: *
L400 = L: as L200 on sheet 3EWL1-200001_03; FirstPublished: 2012/10/14; LatestRevisionDate: *; LatestRevisionNote: *; PackageReference: *; Manufacturer Part Number: MPZ1608S601ATA00; Mounting: *; Footprint(imperial): '0603; Footprint(metric): 1608; Value: 600ohm/1.0A/150mohm
Q400 = NCE2003: as Q100 on sheet 3EWL1-200001_02; Mounting: *; Manufacturer Part Number: NCE2003; Value: NCE2003
R400 = R: 2.2, 2W, 6432Size; Manufacturer: EverOhms; Manufacturer Part Number: CRH2512F2R20E04Z; Description 1: Resistor; Replace: OK; FirstPublished: 2012/10/14; LatestRevisionDate: *; LatestRevisionNote: *; PackageReference: *; Mounting: *; Description 2: *; Value: 2.2/2W; Commodity: Resistor; Footprint(imperial): 2512; Footprint(metric): 6432
R401 = R: as R108 on sheet 3EWL1-200001_02; FirstPublished: 2012/10/14; LatestRevisionDate: *; LatestRevisionNote: *; PackageReference: *; Mounting: *; Description 2: *; Value: 10k; Commodity: Resistor; Footprint(imperial): 0402; Footprint(metric): 1005

## Nets that join several sheets
GND: 3EWL1-200001_02 (43 pins), 3EWL1-200001_03 (9 pins), 3EWL1-200001_04 (34 pins), 3EWL1-200001_05 (5 pins)
P3R3VD: 3EWL1-200001_02 (13 pins), 3EWL1-200001_04 (8 pins)
P5R1V: 3EWL1-200001_02 (8 pins), 3EWL1-200001_03 (C200.1 Q200.2 R202.1), 3EWL1-200001_04 (D301.A D302.A D303.A J300.5)
VBAT: 3EWL1-200001_02 (12 pins), 3EWL1-200001_04 (Q302.2 R311.1), 3EWL1-200001_05 (L400.1)
CHG_EN: 3EWL1-200001_02 (Q103.1 R118.1), 3EWL1-200001_04 (U300.7)
CHGn: 3EWL1-200001_02 (R106.1 U103.3), 3EWL1-200001_04 (R300.2 U300.8)
FORCE_POWER_ONn: 3EWL1-200001_02 (D106.K Q103.6 R111.2), 3EWL1-200001_04 (D300.K SW300.1 SW300.2 TP300.1)
LED_PWM: 3EWL1-200001_04 (R303.2 R304.2), 3EWL1-200001_05 (Q400.1 R401.1)
UART_COMM_to_MCU: 3EWL1-200001_02 (R105.1 TP101.1 U100.11), 3EWL1-200001_04 (U300.17)
UART_MCU_to_COMM: 3EWL1-200001_02 (R101.1 TP100.1), 3EWL1-200001_04 (U300.18)
USB_Output_EN: 3EWL1-200001_03 (Q200.1 R207.1), 3EWL1-200001_04 (U300.9)
VMON_VIN: 3EWL1-200001_02 (6 pins), 3EWL1-200001_04 (Q301.2 R313.1)